# Altium project Motor_Breakout.PrjPCB
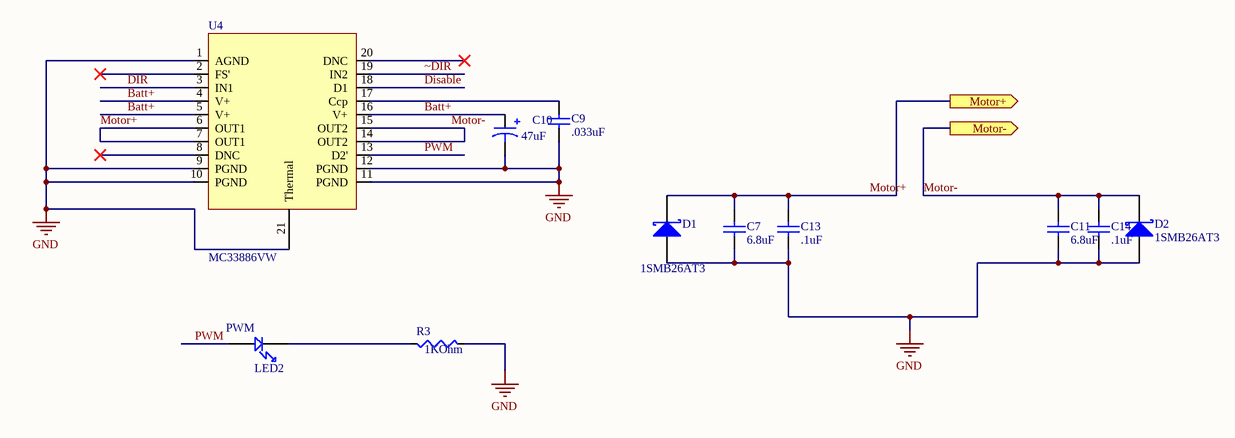
[diagram p0: Motor_Breakout.SchDoc]
1 sheet, 11 parts. Net scope: flat (ports and power ports of the same name join across sheets).
Board file: Motor_Breakout.PcbDoc

## Sheet Motor_Breakout.SchDoc
size A

### Parts
C7  6.8uF  [R 1210 (3225) RESISTOR]
C9  .033uF  [0805 (2012) Capacitor]
C10  47uF  [Radial_6.3mmDia_SM_D]
C11  6.8uF  [R 1210 (3225) RESISTOR]
C13  .1uF  [0805 (2012) Capacitor]
C14  .1uF  [0805 (2012) Capacitor]
D1  1SMB26AT3  [SMB]
D2  1SMB26AT3  [SMB]
LED2  PWM  [LED 0805]
R3  1KOhm  [R 0805 (2012) RESISTOR]
U4  MC33886VW  [SOP127P1420X340_HS-20N]

### Ports
Motor+ (out), Motor- (out)

### Nets
GND: C7.1 C9.1 C10.N C11.1 C13.1 C14.1 D1.1(A) D2.1(A) R3.2 U4.1(AGND) U4.9(PGND) U4.10(PGND) U4.11(PGND) U4.12(PGND) U4.21(Thermal)
Batt+: C10.P U4.4(V+) U4.5(V+) U4.16(V+)
DIR: U4.3(IN1)
Disable: U4.18(D1)
Motor+: C7.2 C13.2 D1.2(K) U4.6(OUT1) U4.7(OUT1) ; port Motor+
Motor-: C11.2 C14.2 D2.2(K) U4.14(OUT2) U4.15(OUT2) ; port Motor-
PWM: LED2.2 U4.13(D2')
~DIR: U4.19(IN2)
NetC9_2: C9.2 U4.17(Ccp)
NetLED2_1: LED2.1 R3.1

Not connected (* = marked no-connect by the designer): U4 2(FS')* 8(DNC)* 20(DNC)*

### Library data of the parts
C7 C9 C11 = Capacitor (non-polarized): Capacitor; Value: .1uF
C10 = Capacitor (polarized)
C13 C14 = Capacitor (non-polarized): Capacitor; Value: .1uF
D1 D2 = D Schottky: Schottky Diode; Published: 8-Jun-2000; LatestRevisionDate: 17-Jul-2002; LatestRevisionNote: Re-released for DXP Platform.; PackageReference: SMB; Publisher: Altium Limited; Code_JEDEC: DO-214-AA
LED2 = LED: Standard LED
R3 = Resistor: Value: 0Ohm
U4 = MC33886VW: Motor Controller